# Altium schematic sheet 05-Signal_Conditioning.SchDoc
size C
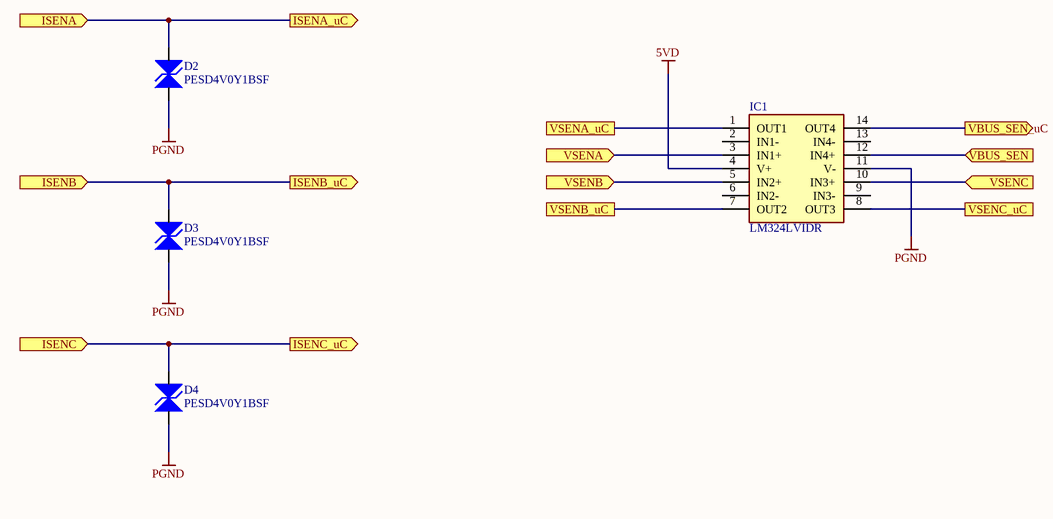
[diagram p0: 05-Signal_Conditioning.SchDoc]

## Parts
D2  PESD4V0Y1BSF  [DFN40P60X32-2M]
D3  PESD4V0Y1BSF  [DFN40P60X32-2M]
D4  PESD4V0Y1BSF  [DFN40P60X32-2M]
IC1  LM324LVIDR  [SOIC127P600X175-14N]

## Ports
ISENA (in), ISENA_uC (out), ISENB (in), ISENB_uC (out), ISENC (in), ISENC_uC (out), VBUS_SEN (in), VBUS_SEN_uC (out), VSENA (in), VSENA_uC, VSENB (in), VSENB_uC, VSENC (in), VSENC_uC

## Nets
5VD: IC1.4(V+)
PGND: D2.1 D3.1 D4.1 IC1.11(V-)
ISENA: D2.2 ; port ISENA_uC, port ISENA
ISENB: D3.2 ; port ISENB_uC, port ISENB
ISENC: D4.2 ; port ISENC_uC, port ISENC
VBUS_SEN: IC1.12(IN4+) ; port VBUS_SEN
VBUS_SEN_uC: IC1.14(OUT4) ; port VBUS_SEN_uC
VSENA: IC1.3(IN1+) ; port VSENA
VSENA_uC: IC1.1(OUT1) ; port VSENA_uC
VSENB: IC1.5(IN2+) ; port VSENB
VSENB_uC: IC1.7(OUT2) ; port VSENB_uC
VSENC: IC1.10(IN3+) ; port VSENC
VSENC_uC: IC1.8(OUT3) ; port VSENC_uC

Not connected (* = marked no-connect by the designer): IC1 2(IN1-) 6(IN2-) 9(IN3-) 13(IN4-)

## Library data of the parts
IC1 = LM324LVIDR: Integrated Circuit; Manufacturer_Name: Texas Instruments; Datasheet Link: http://www.ti.com/lit/gpn/lm324lv; Height: 1.75mm; Manufacturer_Part_Number: LM324LVIDR; Mouser Part Number: 595-LM324LVIDR; Mouser Price/Stock: https://www.mouser.com/Search/Refine.aspx?Keyword=595-LM324LVIDR